# EAGLE design Codeshelf-0007.v1.r1 (EAGLE 5.11)
MFGN: FCI; MFGP: 54602-908LF; PRICE: 0.02
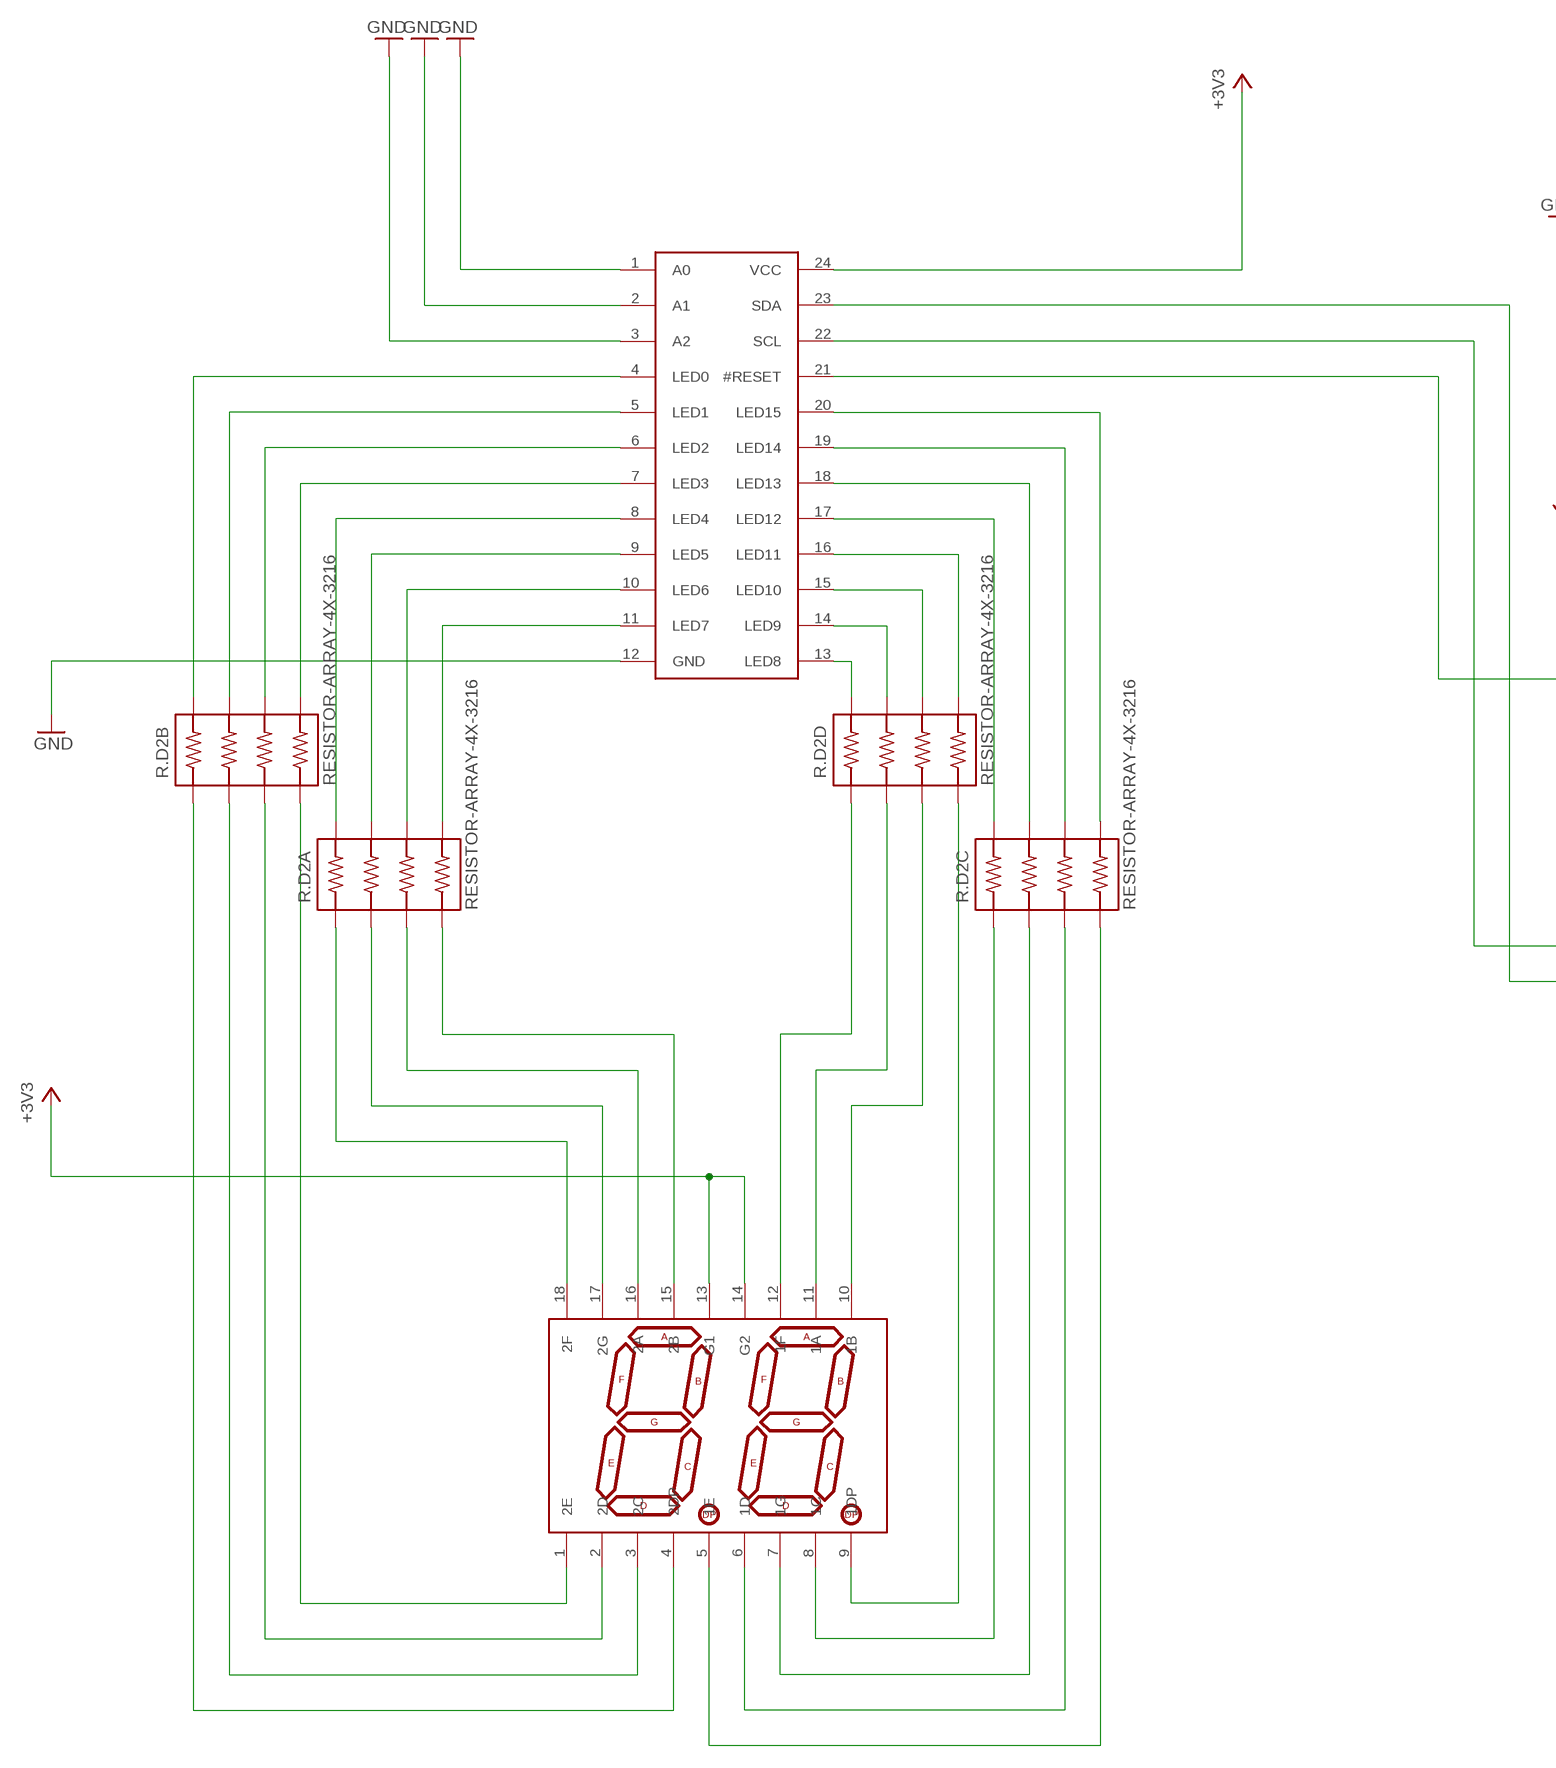
[diagram p0: schematic, sheet 1, part 1 of 2]
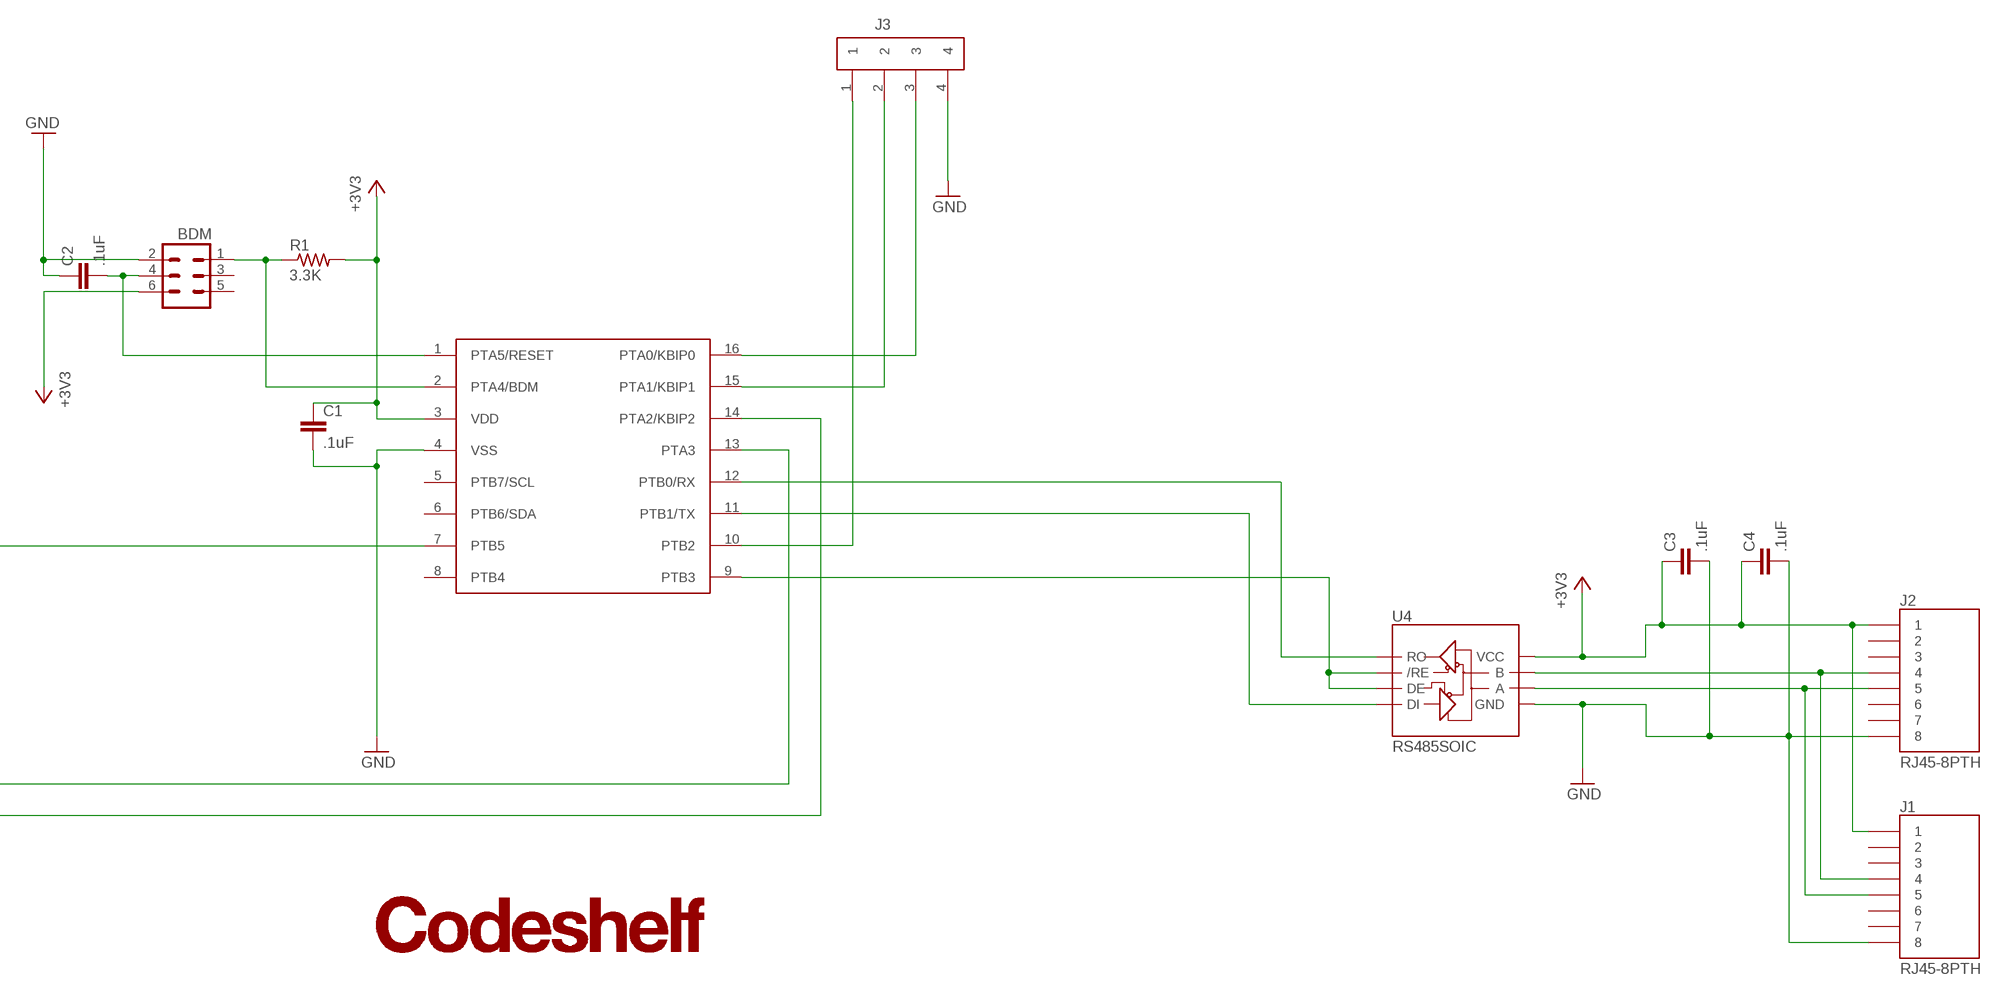
[diagram p1: schematic, sheet 1, part 2 of 2]

## Parts
BDM  HEADER-3X2  [HEADER-3X2]
C1  .1uF  RF-C0402  [RF-C0402]
C2  .1uF  RF-C0402  [RF-C0402]
C3  .1uF  RF-C0402  [RF-C0402]
C4  .1uF  RF-C0402  [RF-C0402]
J1  RJ45-8PTH  [RJ45-8]
J2  RJ45-8PTH  [RJ45-8]
J3  HEADER-4X39357  [MOLEX-39357-0004]
LOGO  CODESHELF-LOGO  [CODESHELF-LOGO]
R1  3.3K  RF-R0402  [RF-R0402]
R.D2A  RESISTOR-ARRAY-4X-3216  [3216-4X]
R.D2B  RESISTOR-ARRAY-4X-3216  [3216-4X]
R.D2C  RESISTOR-ARRAY-4X-3216  [3216-4X]
R.D2D  RESISTOR-ARRAY-4X-3216  [3216-4X]
U2  MC9S08QG-DT  [TSSOP16]
U3  CAT9552  [TSSOP24]
U4  RS485SOIC  [SO08]
U7  7SEGMENT-2DIGIT  [7SEGMENT-2DIG-.54]

## Nets
+3V3 [+3V3]: BDM.6 C1.1 C3.1 C4.1 J1.1 J2.1 R1.2 U2.3(VDD) U3.24(VCC) U4.8(VCC) U7.13(G1) U7.14(G2)
A: J1.5 J2.5 U4.6(A)
B: J1.4 J2.4 U4.7(B)
GND [GND]: BDM.2 C1.2 C2.1 C3.2 J1.8 J2.8 J3.4 U2.4(VSS) U3.1(A0) U3.2(A1) U3.3(A2) U3.12(GND) U4.5(GND)
N$6: J3.3 U2.16(PTA0/KBIP0)
N$7: J3.2 U2.15(PTA1/KBIP1)
N$8: J3.1 U2.10(PTB2)
N$9: BDM.1 R1.1 U2.2(PTA4/BDM)
N$11: R.D2D.8(1B) U3.13(LED8)
N$12: R.D2D.7(2B) U3.14(LED9)
N$13: R.D2D.6(3B) U3.15(LED10)
N$14: R.D2D.5(4B) U3.16(LED11)
N$15: R.D2C.8(1B) U3.17(LED12)
N$16: R.D2C.7(2B) U3.18(LED13)
N$17: R.D2C.6(3B) U3.19(LED14)
N$18: R.D2C.5(4B) U3.20(LED15)
N$19: U2.9(PTB3) U4.2(/RE) U4.3(DE)
N$21: C4.2
N$23: BDM.4 C2.2 U2.1(PTA5/RESET)
N$46: R.D2A.5(4B) U3.11(LED7)
N$54: R.D2A.6(3B) U3.10(LED6)
N$55: R.D2A.7(2B) U3.9(LED5)
N$62: R.D2A.1(1A) U7.18(2F)
N$63: R.D2A.2(2A) U7.17(2G)
N$71: R.D2A.8(1B) U3.8(LED4)
N$72: R.D2B.5(4B) U3.7(LED3)
N$73: R.D2B.6(3B) U3.6(LED2)
N$74: R.D2B.7(2B) U3.5(LED1)
N$76: R.D2B.8(1B) U3.4(LED0)
N$77: R.D2A.3(3A) U7.16(2A)
N$78: R.D2A.4(4A) U7.15(2B)
N$79: R.D2B.4(4A) U7.1(2E)
N$80: R.D2B.3(3A) U7.2(2D)
N$81: R.D2B.2(2A) U7.3(2C)
N$82: R.D2B.1(1A) U7.4(2DP)
N$86: R.D2D.1(1A) U7.12(1F)
N$87: R.D2D.2(2A) U7.11(1A)
N$88: R.D2D.3(3A) U7.10(1B)
N$89: R.D2D.4(4A) U7.9(1DP)
N$90: R.D2C.1(1A) U7.8(1C)
N$91: R.D2C.2(2A) U7.7(1G)
N$92: R.D2C.3(3A) U7.6(1D)
N$93: R.D2C.4(4A) U7.5(1E)
RESET: U2.7(PTB5) U3.21(#RESET)
RX: U2.12(PTB0/RX) U4.1(RO)
SLA: U2.14(PTA2/KBIP2) U3.23(SDA)
SLC: U2.13(PTA3) U3.22(SCL)
TX: U2.11(PTB1/TX) U4.4(DI)
Unconnected: BDM.3 BDM.5 J1.2 J1.3 J1.6 J1.7 J2.2 J2.3 J2.6 J2.7 U2.5(PTB7/SCL) U2.6(PTB6/SDA) U2.8(PTB4)

## Library data of the parts
BDM = GW-devices:HEADER-3X2
C1-C4 = GW-devices:RF-C: RF capacitor pads for FSL reference design
J1 J2 = SparkFun:RJ45-8: RJ45 Jack Simple RJ45, 8-pin connection - connector for common Cat5, Cat5e, and Cat6 Ethernet cables. Footprint not yet proven in production. Connector sku is PRT-00643; Breakout PCB sku is BOB-00716.
J3 = GW-devices:HEADER-4X: 4 position pin header
LOGO = GW-devices:CODESHELF-LOGO
R1 = GW-devices:RF-R: RF resistor pads for FSL reference design
R.D2A R.D2B R.D2C R.D2D = GW-devices:RESISTOR-ARRAY-4X
U2 = GW-devices:MC9S08QG
U3 = GW-devices:CAT9552; MFGN: On Semiconductor; MFGP: CAT9552YI-T2; PRICE: 1.28
U4 = SparkFun:RS485
U7 = GW-devices:7SEGMENT-2DIGIT: 7-Segment Display 1" Red (COM-08546)

## Net classes
1 +3V3: width 0.3 mm
2 GND: width 0.3 mm
3 RS485: width 0.4 mm

## Board
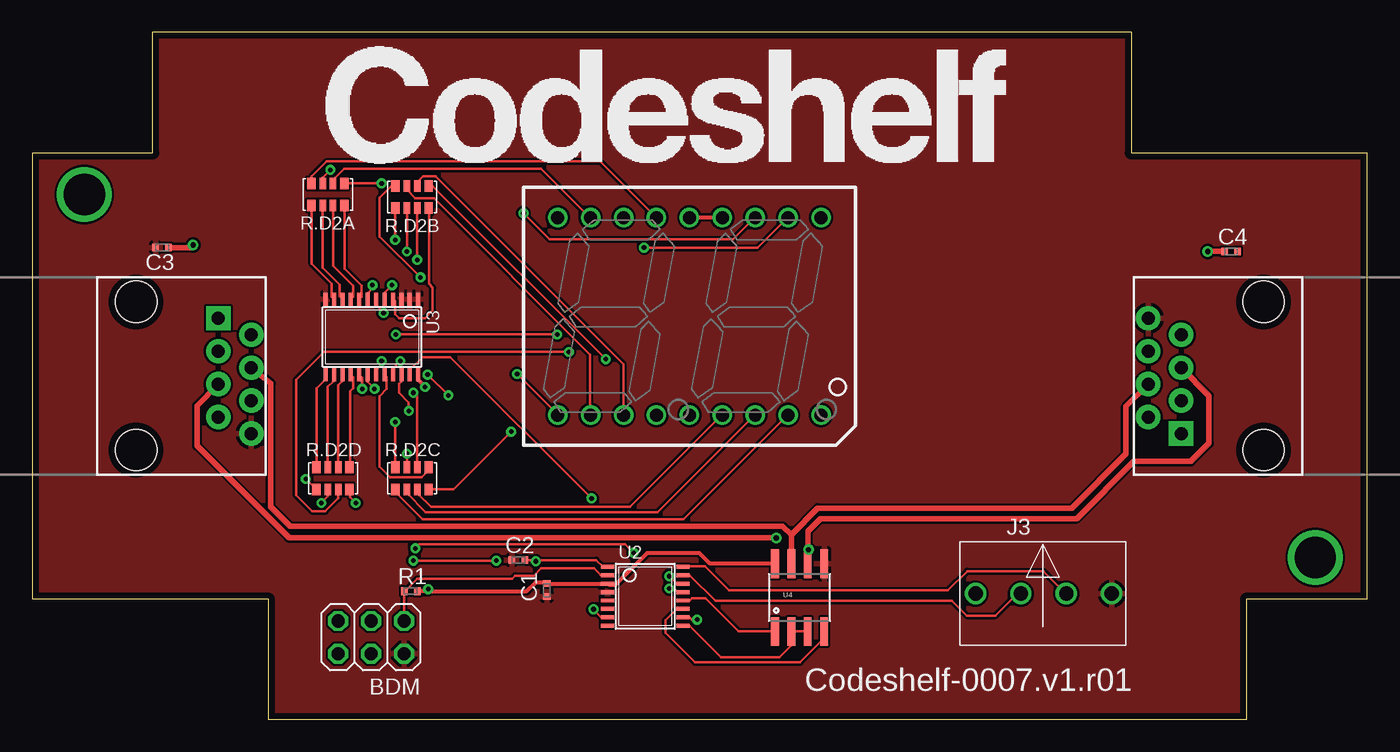
[diagram p2: board, top side]
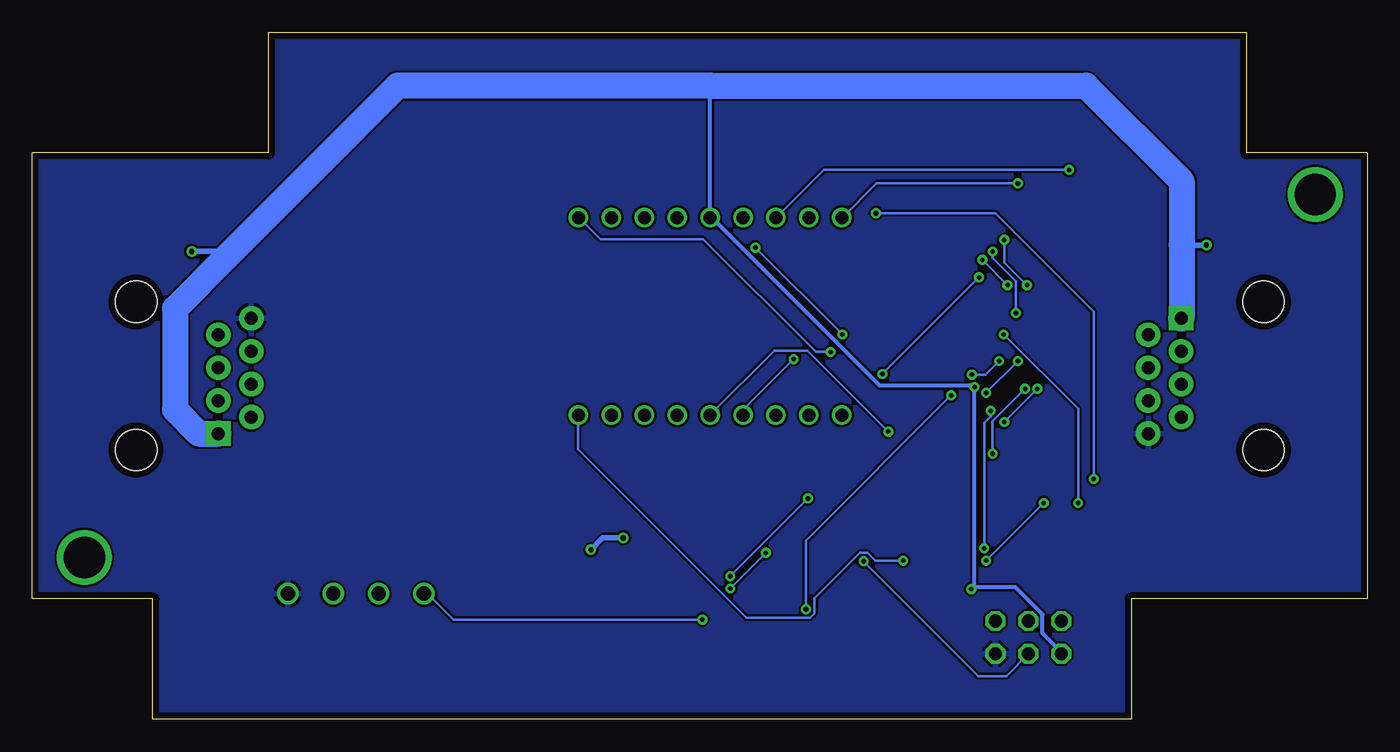
[diagram p3: board, bottom side, seen from below]

Size 103 x 53 mm. Coordinates in mm from the lower left corner, seen from the top.
Outline: 18.2,0 93.7,0 93.7,9.3 103,9.3 103,43.7 84.8,43.7 84.8,53 9.3,53 9.3,43.7 0,43.7 0,9.3 18.2,9.3 18.2,0
Copper layers (1*16): Top 0.0356mm / dielectric 1.5011mm / Bottom 0.0356mm
Design rules "SilverCircuits": minimum track width 7mil, minimum drill 14mil, track to track 7mil, track to pad 7mil, pad to pad 7mil, via to via 7mil, smd to smd 0mil, copper to edge 20mil, drill to drill 8mil, minimum pad ring 10mil, minimum via ring 8mil, stop-mask expansion 4mil, vias tented up to drill 0mil, thermal gap 10mil

### Footprints (pad centres in the part's own frame; a part is rotated, then mirrored left to right if it is on the bottom)
HEADER-3X2 = drill 1.016 octagon: 1 -5.08,0; 2 -5.08,2.54; 3 -2.54,0; 4 -2.54,2.54; 5 0,0; 6 0,2.54
RF-C0402 = smd 0.5 x 0.6: 1 -0.5,0; 2 0.5,0
RJ45-8 = drill 1 pad 1.88 square: 1 -4.445,6.35 | drill 1 pad 1.88: 2 -3.175,8.89; 3 -1.905,6.35; 4 -0.635,8.89; 5 0.635,6.35; 6 1.905,8.89; 7 3.175,6.35; 8 4.445,8.89 | hole 3.2: -5.715,0; 5.715,0
MOLEX-39357-0004 = drill 1.1: 1 -5.2,0; 2 -1.7,0; 3 1.8,0; 4 5.3,0
RF-R0402 = smd 0.5 x 0.6: 1 -0.5,0; 2 0.5,0
3216-4X = smd 0.65 x 0.9: 1 -1.275,-0.85; 4 1.275,-0.85; 5 1.275,0.85; 8 -1.275,0.85 | smd 0.5 x 0.9: 2 -0.4,-0.85; 3 0.4,-0.85; 6 0.4,0.85; 7 -0.4,0.85
TSSOP16 = smd 0.305 x 0.991: 1 -2.275,-2.918; 2 -1.625,-2.918; 3 -0.975,-2.918; 4 -0.325,-2.918; 5 0.325,-2.918; 6 0.975,-2.918; 7 1.625,-2.918; 8 2.275,-2.918; 9 2.275,2.918; 10 1.625,2.918; 11 0.975,2.918; 12 0.325,2.918; 13 -0.325,2.918; 14 -0.975,2.918; 15 -1.625,2.918; 16 -2.275,2.918
TSSOP24 = smd 0.305 x 0.991: 1 -3.575,-2.918; 2 -2.925,-2.918; 3 -2.275,-2.918; 4 -1.625,-2.918; 5 -0.975,-2.918; 6 -0.325,-2.918; 7 0.325,-2.918; 8 0.975,-2.918; 9 1.625,-2.918; 10 2.275,-2.918; 11 2.925,-2.918; 12 3.575,-2.918; 13 3.575,2.918; 14 2.925,2.918; 15 2.275,2.918; 16 1.625,2.918; 17 0.975,2.918; 18 0.325,2.918; 19 -0.325,2.918; 20 -0.975,2.918; 21 -1.625,2.918; 22 -2.275,2.918; 23 -2.925,2.918; 24 -3.575,2.918
SO08 = smd 0.61 x 2.21: 1 -1.905,-2.616; 2 -0.635,-2.616; 3 0.635,-2.616; 4 1.905,-2.616; 5 1.905,2.616; 6 0.635,2.616; 7 -0.635,2.616; 8 -1.905,2.616
7SEGMENT-2DIG-.54 = drill 1: 1 -10.16,-7.62; 2 -7.62,-7.62; 3 -5.08,-7.62; 4 -2.54,-7.62; 5 0,-7.62; 6 2.54,-7.62; 7 5.08,-7.62; 8 7.62,-7.62; 9 10.16,-7.62; 10 10.16,7.62; 11 7.62,7.62; 12 5.08,7.62; 13 2.54,7.62; 14 0,7.62; 15 -2.54,7.62; 16 -5.08,7.62; 17 -7.62,7.62; 18 -10.16,7.62

### Placement (x,y rotation side)
BDM  23.6,7.6 180 top
C1  39.7,9.98 270 top
C2  37.5,12.3 0 top
C3  10,36.4 180 top
C4  92.5,36.1 0 top
J1  95,26.5 90 top
J2  8,26.5 270 top
J3  77.98,9.71 0 top
LOGO  47.4,45.7 0 top
R1  29.2,9.9 0 top
R.D2A  22.8,40.5 180 top
R.D2B  29.3,40.3 180 top
R.D2C  29.3,18.6 0 top
R.D2D  23.2,18.6 0 top
U2  47.3,9.5 270 top
U3  26.2,29.5 180 top
U4  59.2,9.4 0 top
U7  50.7,31.1 0 top

### Tracks (layer width: path | path; a pad name or v marks a point on that pad's centre or on a via)
+3V3  (via drill 0.36, 0.4)
  Top 0.3: U7.14 50.7,38.75 53.2,38.75 U7.13 | 30.55,9.9 38.15,9.9 38.85,10.6 39.55,10.6 39.7,10.45 C1.1 39.8,10.45 44.35,10.45 U2.3 44.5,10.4 45,10.4 47.45,12.85 51.45,12.85 52.25,12.05 57.25,12.05 U4.8 | 30.55,9.9 R1.2 | v30.3,25.65 29.75,26.2 29.75,26.55 U3.24 | v30.55,10.05 30.55,9.9
  Top 0.406: C3.1 12.2,36.4 v12.4,36.6 | v90.7,36.1 C4.1
  Bottom 0.3: 50.7,48.9 U7.14 50.6,38.65 50.5,38.65 37.6,25.75 30.4,25.75 v30.3,25.65 30.3,10.3 v30.55,10.05 30.2,10.2 27.15,10.2 25.05,8.1 25.05,6.65 23.6,5.2 BDM.6
  Bottom 0.406: 14.3,36.6 v12.4,36.6 | v90.7,36.1 88.3,36.1 87.95,35.75
  Bottom 2: J1.1 90.16,22.05 92,23.9 92,31.7 87.95,35.75 74.8,48.9 50.7,48.9 21.7,48.9 14.3,41.5 14.3,36.6 14.3,31 J2.1
A  (via drill 0.4)
  Top 0.406: U4.6 59.84,13.04 v59.9,13.1 59.84,13.16 59.84,14.54 60.8,15.5 80.6,15.5 85,19.9 89.4,19.9 90.8,21.3 90.8,24.98 J1.5 | v57.4,14 19.8,14 12.7,21.1 12.7,24.21 J2.5
  Bottom 0.406: v59.9,13.1 59,14 v57.4,14
B
  Top 0.406: J1.4 84.4,24.16 84.4,20.5 80.2,16.3 60.6,16.3 58.56,14.27 U4.7 58.56,14.23 57.9,14.9 19.9,14.9 18.4,16.4 18.4,25.93 J2.4
GND
  pour Top: 0,9.3 0,43.7 9.3,43.7 9.3,53 84.8,53 84.8,43.7 103,43.7 103,9.2 93.7,9.2 93.7,0 18.2,0 18.2,9.3
  pour Bottom: 0,9.3 0,43.7 9.3,43.7 9.3,53 84.8,53 84.8,43.7 103,43.7 103,9.2 93.7,9.2 93.7,0 18.2,0 18.2,9.3
N$4  (via drill 3.2)
  other vias: 99,12.5
N$5  (via drill 3.2)
  other vias: 4,40.5
N$6
  Top 0.178: U2.16 50.25,11.8 51.9,11.8 53.75,9.95 70.65,9.95 72.15,11.45 78,11.45 79.75,9.7 J3.3
N$7
  Top 0.178: U2.15 50.25,11.1 50.75,11.1 52.7,9.15 70.95,9.15 72.1,8 74.3,8 76,9.7 76.25,9.7 J3.2
N$8  (via drill 0.36)
  Top 0.178: v51.3,7.7 50.9,7.7 50.75,7.85 50.25,7.85 U2.10
  Bottom 0.178: v51.3,7.7 70.5,7.7 72.5,9.7 72.75,9.7 J3.1
N$9
  Top 0.178: BDM.1 28.7,7.6 R1.1 28.75,9.9 29.7,10.85 37,10.85 37.25,11.1 38.7,11.1 39.25,11.65 43.35,11.65 43.85,11.15 44.35,11.15 U2.2
N$11
  Top 0.178: R.D2D.8 21.95,19.45 21.95,25.55 22.6,26.2 22.6,26.55 U3.13
N$12
  Top 0.178: R.D2D.7 22.8,25.65 23.25,26.1 23.25,26.55 U3.14
N$13
  Top 0.178: R.D2D.6 23.6,25.8 23.9,26.1 23.9,26.55 U3.15
N$14
  Top 0.178: R.D2D.5 24.5,19.45 24.5,25.3 24.75,25.55 24.75,26.4 24.6,26.55 U3.16
N$15  (via drill 0.36)
  Top 0.178: v28,22.95 28,19.45 R.D2C.8 | v25.45,25.5 25.45,26.35 25.25,26.55 U3.17
  Bottom 0.178: v28,22.95 v25.45,25.5
N$16  (via drill 0.36)
  Top 0.178: R.D2C.7 v28.9,20.5 | v26.4,25.5 25.85,26.05 25.85,26.55 U3.18
  Bottom 0.178: v28.9,20.5 28.9,23 v26.4,25.5
N$17  (via drill 0.36)
  Top 0.178: R.D2C.6 29.7,24.9 v29.4,25.2 | v26.95,27.65 26.95,27.4 26.55,27 26.55,26.6 U3.19
  Bottom 0.178: v29.4,25.2 v26.95,27.65
N$18
  Top 0.178: R.D2C.5 30.55,19.45 30.55,19.2 30.05,18.7 27.6,18.7 26.8,19.5 26.8,24.95 27.35,25.5 27.35,26.4 27.2,26.55 U3.20
N$19
  Top 0.178: U2.9 50.25,7.2 50.75,7.2 53.15,4.8 57.65,4.8 58.55,5.7 58.55,6.75 U4.2 58.65,6.8 59.8,6.8 U4.3
N$23  (via drill 0.36)
  Top 0.178: 38.85,12.3 43.5,12.3 44,11.8 44.35,11.8 U2.1 | 38.85,12.3 C2.2 | v38.85,12.2 38.85,12.3
  Bottom 0.178: v38.85,12.2 30,3.35 27.85,3.35 BDM.4
N$46
  Top 0.178: R.D2A.5 21.55,39.65 21.55,35.15 23.1,33.6 23.1,32.6 23.25,32.45 U3.11
N$54
  Top 0.178: R.D2A.6 22.4,34.85 23.7,33.55 23.7,32.65 23.9,32.45 U3.10
N$55
  Top 0.178: R.D2A.7 23.2,35 24.75,33.45 24.75,32.6 24.6,32.45 U3.9
N$62  (via drill 0.36)
  Top 0.178: R.D2A.1 v26.95,41.35
  Bottom 0.178: v26.95,41.35 37.85,41.35 40.5,38.7 U7.18
N$63
  Top 0.178: R.D2A.2 23.2,41.65 24.05,42.5 39.25,42.5 43.05,38.7 U7.17
N$71
  Top 0.178: R.D2A.8 24.1,39.65 24.1,34.75 25.4,33.45 25.4,32.6 25.25,32.45 U3.8
N$72  (via drill 0.36)
  Top 0.178: v28,37 28,39.45 R.D2B.5 | v26.25,33.5 26.25,33.25 25.9,32.9 25.9,32.45 U3.7
  Bottom 0.178: v28,37 28,35.25 v26.25,33.5
N$73  (via drill 0.36)
  Top 0.178: v28.9,36.1 R.D2B.6 | v27.1,31.35 26.55,31.9 26.55,32.4 U3.6
  Bottom 0.178: v28.9,36.1 28.9,35.6 27.1,33.8 v27.1,31.35
N$74  (via drill 0.36)
  Top 0.178: v29.7,35.45 R.D2B.7 | v27.75,33.5 27.2,32.95 27.2,32.45 U3.5
  Bottom 0.178: v27.75,33.5 v29.7,35.45
N$76
  Top 0.178: R.D2B.8 30.6,39.45 30.6,33.6 30.9,33.3 30.9,31.55 30.3,30.95 28.3,30.95 28,31.25 28,32.25 27.85,32.4 U3.4
N$77  (via drill 0.36)
  Top 0.178: R.D2A.3 22.4,41.8 v23,42.4
  Bottom 0.178: v23,42.4 41.9,42.4 45.6,38.7 U7.16
N$78
  Top 0.178: R.D2A.4 21.55,41.35 21.55,41.9 22.7,43.05 43.8,43.05 48.15,38.7 U7.15
N$79  (via drill 0.36)
  Top 0.178: v29.95,34.1 26.8,37.25 26.8,40.25 27.7,41.15 R.D2B.4 | v37.4,26.65 40.55,23.5 U7.1
  Bottom 0.178: v37.4,26.65 v29.95,34.1
N$80
  Top 0.178: R.D2B.3 28.9,40.85 29.55,40.2 31,40.2 43.05,28.15 43.05,23.5 U7.2
N$81
  Top 0.178: R.D2B.2 29.7,41.45 30.15,41.9 31.1,41.9 45.6,27.4 45.6,23.5 U7.3
N$82  (via drill 0.36)
  Top 0.178: v44.25,27.8 30.9,41.15 R.D2B.1
  Bottom 0.178: v44.25,27.8 48.15,23.9 48.15,23.5 U7.4
N$86  (via drill 0.36)
  Top 0.178: v21.1,18.55 21.9,17.75 R.D2D.1 | v37.9,39.05 39.9,37.05 54.05,37.05 55.75,38.75 U7.12
  Bottom 0.178: v21.1,18.55 21.1,31.45 28.7,39.05 v37.9,39.05
N$87  (via drill 0.36)
  Top 0.178: R.D2D.2 22.8,17.2 v22.3,16.7 | v28.05,29.7 v40.5,29.7 | v47.2,36.4 55.95,36.4 58.3,38.75 U7.11
  Bottom 0.178: v22.3,16.7 22.3,23.95 v28.05,29.7 | v40.5,29.7 v47.2,36.4
N$88  (via drill 0.36)
  Top 0.178: R.D2D.3 23.6,17.05 22.6,16.05 21.6,16.05 20.35,17.3 20.35,26.2 22.5,28.35 v41.4,28.35
  Bottom 0.178: v41.4,28.35 42.55,28.35 51.25,37.05 59.15,37.05 60.85,38.75 U7.10
N$89  (via drill 0.36)
  Top 0.178: v24.95,16.7 24.5,17.15 24.5,17.75 R.D2D.4 | v29.4,12.25 v35.8,12.25
  Bottom 0.178: v24.95,16.7 v29.4,12.25 | v35.8,12.25 37.95,12.25 38.55,12.85 39.15,12.85 42.65,9.35 42.65,8.2 43,7.85 47.9,7.85 60.9,20.85 60.9,23.45 U7.9
N$90
  Top 0.178: R.D2C.1 28.05,17.75 28.05,17.5 30.1,15.45 50.25,15.45 58.3,23.5 U7.8
N$91
  Top 0.178: R.D2C.2 28.9,17.45 30.35,16 48.25,16 55.75,23.5 U7.7
N$92
  Top 0.178: R.D2C.3 29.7,17.45 30.75,16.4 46.1,16.4 53.2,23.5 U7.6
N$93  (via drill 0.36)
  Top 0.178: v36.95,22.2 32.5,17.75 R.D2C.4
  Bottom 0.178: v36.95,22.2 43.2,28.45 45.75,28.45 50.7,23.5 U7.5
RESET  (via drill 0.36)
  Top 0.178: v43.3,8.5 43.9,7.9 44.35,7.9 U2.7 | v32.1,25 v30.5,26.6 | v28.4,27.65 27.85,27.1 27.85,26.6 U3.21
  Bottom 0.178: v43.3,8.5 43.3,13.8 v32.1,25 | v30.5,26.6 29.45,26.6 v28.4,27.65
RX
  Top 0.178: U2.12 50.25,9.2 50.75,9.2 50.9,9.35 51.95,9.35 54.5,6.8 57.25,6.8 U4.1
SLA  (via drill 0.36)
  Top 0.178: v43.15,17.05 32.25,27.95 30.1,27.95 29.15,27 29.15,26.6 U3.23 | v49.15,11.05 49.7,10.5 50.2,10.5 U2.14
  Bottom 0.178: v43.15,17.05 v49.15,11.05
SLC  (via drill 0.36)
  Top 0.178: v29.05,23.8 29.05,24.45 28.3,25.2 28.3,25.9 28.45,26.05 28.45,26.55 U3.22 | v29.55,13.2 29.85,13.5 45.75,13.5 v46.4,12.85 | v49.15,10.1 49.55,10.1 49.8,9.85 50.2,9.85 U2.13
  Bottom 0.178: v29.05,23.8 29.05,23.4 29.55,22.9 v29.55,13.2 | v46.4,12.85 v49.15,10.1
TX
  Top 0.178: U2.11 50.2,8.5 49.7,8.5 48.85,7.65 48.85,6.7 51.15,4.4 59.25,4.4 61.1,6.25 61.1,6.75 U4.4

### Text on the board
tPlace: Codeshelf-0007.v1.r01